# Altium schematic sheet current_mp6519.SchDoc
size A
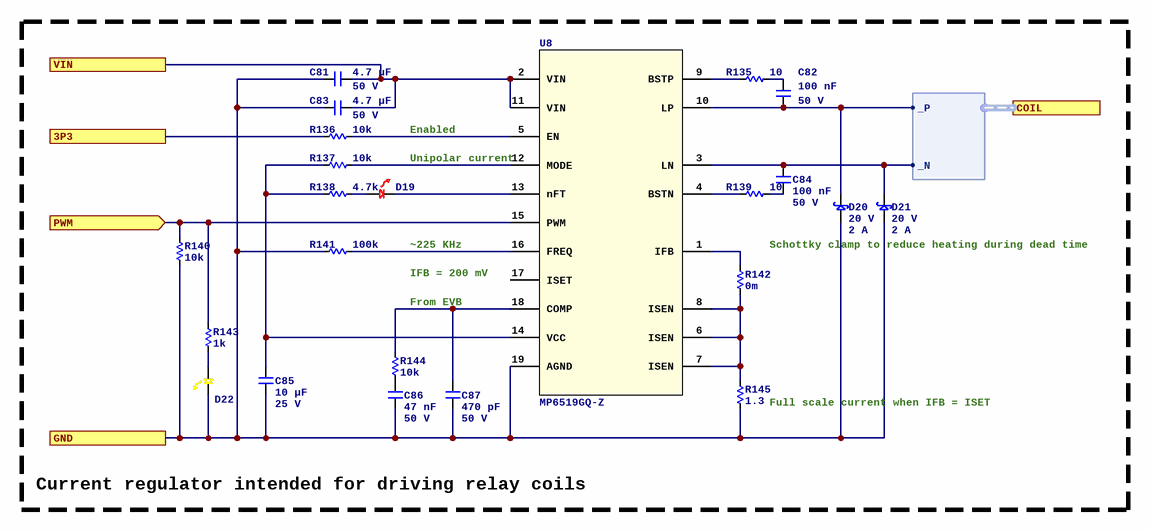
[diagram p0: current_mp6519.SchDoc]

## Parts
C81  Capacitance: 4.7 µF  Voltage Rating: 50 V  [C0805]  (hidden comment: 0805B475K500NT)
C82  Capacitance: 100 nF  Voltage Rating: 50 V  [C0402]  (hidden comment: CL05B104KB54PNC)
C83  Capacitance: 4.7 µF  Voltage Rating: 50 V  [C0805]  (hidden comment: 0805B475K500NT)
C84  Capacitance: 100 nF  Voltage Rating: 50 V  [C0402]  (hidden comment: CL05B104KB54PNC)
C85  Capacitance: 10 µF  Voltage Rating: 25 V  [C0603]  (hidden comment: CL10A106MA8NRNC)
C86  Capacitance: 47 nF  Voltage Rating: 50 V  [C0402]  (hidden comment: 0402B473K500NT)
C87  Capacitance: 470 pF  Voltage Rating: 50 V  [C0402]  (hidden comment: GRM1555C1H471JA01D)
D19  LTST-C190KRKT  [LED_0603P_RED]  (value not drawn)
D20  Vr: 20 V  Current: 2 A  [ESMP]  (hidden comment: MSS2P2-M3/89A)
D21  Vr: 20 V  Current: 2 A  [ESMP]  (hidden comment: MSS2P2-M3/89A)
D22  LTST-C190YKT  [LED_0603P_YELLOW]  (value not drawn)
R135  value 10  [R0402]  (hidden comment: FRC0402F10R0TS)
R136  value 10k  [R0402]  (hidden comment: 0402WGF1002TCE)
R137  value 10k  [R0402]  (hidden comment: 0402WGF1002TCE)
R138  value 4.7k  [R0402]  (hidden comment: 0402WGF4701TCE)
R139  value 10  [R0402]  (hidden comment: FRC0402F10R0TS)
R140  value 10k  [R0402]  (hidden comment: 0402WGF1002TCE)
R141  value 100k  [R0402]  (hidden comment: 0402WGF1003TCE)
R142  value 0m  [R0402]  (hidden comment: 0402WGF0000TCE)
R143  value 1k  [R0402]  (hidden comment: 0402WGF1001TCE)
R144  value 10k  [R0402]  (hidden comment: 0402WGF1002TCE)
R145  value 1.3  [R1206]  (hidden comment: HP06W2F130KT5E)
U8  MP6519GQ-Z  [MP6519]

## Ports
3P3, COIL (harness DIFF), GND, PWM (in), VIN

## Harnesses
DIFF: _N, _P

## Nets
3P3: R136.1 ; port 3P3
GND: C81.1 C83.1 C85.2 C86.2 C87.2 D20.1 D21.1 D22.2 R140.1 R141.2 R145.1 U8.19(AGND) ; port GND
PWM: R140.2 R143.1 U8.15(PWM) ; port PWM
VIN: C81.2 C83.2 U8.2(VIN) U8.11(VIN) ; port VIN
NetC82_1: C82.1 R135.2
NetC82_2: C82.2 D20.2 U8.10(LP) ; port COIL._P
NetC84_1: C84.1 D21.2 U8.3(LN) ; port COIL._N
NetC84_2: C84.2 R139.2
NetC85_1: C85.1 R137.1 R138.1 U8.14(VCC)
NetC86_1: C86.1 R144.1
NetC87_1: C87.1 R144.2 U8.18(COMP)
NetD19_1: D19.1 R138.2
NetD19_2: D19.2 U8.13(nFT)
NetD22_1: D22.1 R143.2
NetR135_1: R135.1 U8.9(BSTP)
NetR136_2: R136.2 U8.5(EN)
NetR137_2: R137.2 U8.12(MODE)
NetR139_1: R139.1 U8.4(BSTN)
NetR141_1: R141.1 U8.16(FREQ)
NetR142_1: R142.1 R145.2 U8.6(ISEN) U8.7(ISEN) U8.8(ISEN)
NetR142_2: R142.2 U8.1(IFB)

Not connected (* = marked no-connect by the designer): U8 17(ISET)

## Notes on the sheet
- Enabled
- Unipolar current
- ~225 KHz
- IFB = 200 mV
- Schottky clamp to reduce heating during dead time
- From EVB
- (near R145) Full scale current when IFB = ISET
- Current regulator intended for driving relay coils

## Library data of the parts
C81 C83 = 0805B475K500NT: Manufacturer: FH (Guangdong Fenghua Advanced Tech); Dielectric: X7R; ComponentLink1URL: https://wmsc.lcsc.com/wmsc/upload/file/pdf/v2/lcsc/2204111630_FH--Guangdong-Fenghua-Advanced-Tech-0805B475K500NT_C2991173.pdf; ComponentLink1Description: Datasheet; Manufacturer Part Number: 0805B475K500NT; Package: 0805; Supplier 2: LCSC; Supplier Part Number 2: C2991173
C82 C84 = CL05B104KB54PNC: Manufacturer: Samsung Electro-Mechanics; Dielectric: X7R; ComponentLink1URL: https://wmsc.lcsc.com/wmsc/upload/file/pdf/v2/lcsc/2304140030_Samsung-Electro-Mechanics-CL05B104KB54PNC_C307331.pdf; ComponentLink1Description: Datasheet; Manufacturer Part Number: CL05B104KB54PNC; Package: 0402; Supplier 2: LCSC; Supplier Part Number 2: C307331
C85 = CL10A106MA8NRNC: Manufacturer: Samsung Electro-Mechanics; Dielectric: X5R; ComponentLink1URL: https://wmsc.lcsc.com/wmsc/upload/file/pdf/v2/lcsc/2304140030_Samsung-Electro-Mechanics-CL10A106MA8NRNC_C96446.pdf; ComponentLink1Description: Datasheet; Manufacturer Part Number: CL10A106MA8NRNC; Package: 0603; Supplier 2: LCSC; Supplier Part Number 2: C96446
C86 = 0402B473K500NT: Manufacturer: FH(Guangdong Fenghua Advanced Tech); Dielectric: X7R; ComponentLink1URL: https://wmsc.lcsc.com/wmsc/upload/file/pdf/v2/lcsc/2304140030_FH--Guangdong-Fenghua-Advanced-Tech-0402B473K500NT_C82219.pdf; ComponentLink1Description: Datasheet; Manufacturer Part Number: 0402B473K500NT; Package: 0402; Supplier 2: LCSC; Supplier Part Number 2: C82219
C87 = GRM1555C1H471JA01D: Manufacturer: Murata Electronics; Dielectric: C0G; ComponentLink1URL: https://wmsc.lcsc.com/wmsc/upload/file/pdf/v2/lcsc/1811081616_Murata-Electronics-GRM1555C1H471JA01D_C76971.pdf; ComponentLink1Description: Datasheet; Manufacturer Part Number: GRM1555C1H471JA01D; Package: 0402; Supplier 2: LCSC; Supplier Part Number 2: C76971
D19 = LTST-C190KRKT: LED SUPER RED CLEAR 0603 SMD; Manufacturer: Lite-On Inc; Vf: 2.0 V; If: 20 mA; ComponentLink1URL: https://optoelectronics.liteon.com/upload/download/DS-22-99-0151/LTST-C190KRKT.pdf; ComponentLink1Description: Datasheet; Supplier 1: DigiKey; Supplier Part Number 1: 160-1436-1-ND; Manufacturer Part Number: LTST-C190KRKT; Supplier 2: LCSC; Supplier Part Number 2: C94869; LED Color: Red; Supplier 3: Mouser; Supplier Part Number 3: 859-LTST-C190KRKT
D20 D21 = MSS2P2-M3/89A: DIODE SCHOTTKY 20V 2A MICROSMP; Manufacturer: Vishay Semiconductor Diodes Division; Supplier 1: DigiKey; Manufacturer Part Number: MSS2P2-M3/89A; ComponentLink1URL: http://www.vishay.com/docs/89054/mss2p3.pdf; ComponentLink1Description: Datasheet; Supplier Part Number 1: MSS2P2-M3/89AGICT-ND; Supplier 2: LCSC; Supplier Part Number 2: C2978531; Diode Type: Schottky; Supplier 3: Mouser; Supplier Part Number 3: 625-MSS2P2-M3
D22 = LTST-C190YKT: LED YELLOW CLEAR 0603 SMD; Manufacturer: Lite-On Inc; Vf: 2.1 V; If: 20 mA; Supplier 1: DigiKey; ComponentLink1URL: https://mm.digikey.com/Volume0/opasdata/d220001/medias/docus/1176/LTST-C190YKT.pdf; ComponentLink1Description: Datasheet; Supplier Part Number 1: 160-1184-1-ND; Manufacturer Part Number: LTST-C190YKT; Supplier 2: LCSC; Supplier Part Number 2: C125097; LED Color: Yellow; Supplier 3: Mouser; Supplier Part Number 3: 859-LTST-C190YKT
R135 R139 = FRC0402F10R0TS: Manufacturer: FOJAN; Tolerance: 1%; Temperature Coefficient: ±100ppm/?; Power Rating (mW): 62.5; ComponentLink1Description: Datasheet; ComponentLink1URL: https://datasheet.lcsc.com/lcsc/2308241947_FOJAN-FRC0402F10R0TS_C2906862.pdf; Manufacturer Part Number: FRC0402F10R0TS; Package: 0402; Supplier 2: LCSC; Supplier Part Number 2: C2906862
R136 R137 R140 R144 = 0402WGF1002TCE: Manufacturer: UNI-ROYAL(Uniroyal Elec); Tolerance: 1%; Temperature Coefficient: ±100ppm/?; Power Rating (mW): 62.5; ComponentLink1Description: Datasheet; ComponentLink1URL: https://wmsc.lcsc.com/wmsc/upload/file/pdf/v2/lcsc/2206010100_UNI-ROYAL-Uniroyal-Elec-0402WGF1002TCE_C25744.pdf; Manufacturer Part Number: 0402WGF1002TCE; Package: 0402; Supplier 2: LCSC; Supplier Part Number 2: C25744
R138 = 0402WGF4701TCE: Manufacturer: UNI-ROYAL(Uniroyal Elec); Tolerance: 1%; Temperature Coefficient: ±100ppm/?; Power Rating (mW): 62.5; ComponentLink1Description: Datasheet; ComponentLink1URL: https://wmsc.lcsc.com/wmsc/upload/file/pdf/v2/lcsc/2206010045_UNI-ROYAL-Uniroyal-Elec-0402WGF4701TCE_C25900.pdf; Manufacturer Part Number: 0402WGF4701TCE; Package: 0402; Supplier 2: LCSC; Supplier Part Number 2: C25900
R141 = 0402WGF1003TCE: Manufacturer: UNI-ROYAL(Uniroyal Elec); Tolerance: 1%; Temperature Coefficient: ±100ppm/?; Power Rating (mW): 62.5; ComponentLink1Description: Datasheet; ComponentLink1URL: https://wmsc.lcsc.com/wmsc/upload/file/pdf/v2/lcsc/2206010100_UNI-ROYAL-Uniroyal-Elec-0402WGF1003TCE_C25741.pdf; Manufacturer Part Number: 0402WGF1003TCE; Package: 0402; Supplier 2: LCSC; Supplier Part Number 2: C25741
R142 = 0402WGF0000TCE: Manufacturer: UNI-ROYAL(Uniroyal Elec); Power Rating (mW): 62.5; ComponentLink1Description: Datasheet; ComponentLink1URL: https://wmsc.lcsc.com/wmsc/upload/file/pdf/v2/lcsc/2206010216_UNI-ROYAL-Uniroyal-Elec-0402WGF0000TCE_C17168.pdf; Manufacturer Part Number: 0402WGF0000TCE; Package: 0402; Supplier 2: LCSC; Supplier Part Number 2: C17168
R143 = 0402WGF1001TCE: Manufacturer: UNI-ROYAL(Uniroyal Elec); Tolerance: 1%; Temperature Coefficient: ±100ppm/?; Power Rating (mW): 62.5; ComponentLink1Description: Datasheet; ComponentLink1URL: https://wmsc.lcsc.com/wmsc/upload/file/pdf/v2/lcsc/2206010216_UNI-ROYAL-Uniroyal-Elec-0402WGF1001TCE_C11702.pdf; Manufacturer Part Number: 0402WGF1001TCE; Package: 0402; Supplier 2: LCSC; Supplier Part Number 2: C11702
R145 = HP06W2F130KT5E: Manufacturer: UNI-ROYAL(Uniroyal Elec); Tolerance: 1%; Temperature Coefficient: ±100ppm/?; Power Rating (mW): 500; ComponentLink1Description: Datasheet; ComponentLink1URL: https://wmsc.lcsc.com/wmsc/upload/file/pdf/v2/lcsc/2304140030_UNI-ROYAL-Uniroyal-Elec-HP06W2F130KT5E_C414957.pdf; Manufacturer Part Number: HP06W2F130KT5E; Package: 1206; Supplier 2: LCSC; Supplier Part Number 2: C414957
U8 = MP6519GQ-Z: 2.5V - 28V, 5A, H-bridge Current Regulator; Manufacturer: Monolithic Power Systems; Supplier 1: DigiKey; Supplier Part Number 1: 1589-2044-1-ND; Manufacturer Part Number: MP6519GQ-Z; ComponentLink1Description: Datasheet; ComponentLink1URL: https://mm.digikey.com/Volume0/opasdata/d220001/medias/docus/696/MP6519_r1.01.pdf; Supplier 3: JLCPCB; Supplier Part Number 3: C2762181